# Altium schematic sheet RPi_CM3_SODIMM_200PIN_1V8.SchDoc: Las Cumbres
size B; DrawnBy: Cary Smith; Organization: Las Cumbres Observatoy; Address1: 6740 Cortona Dr.; Address2: Suite 102; Address3: Goleta, CA 93117; DocumentNumber: 1; Revision: 1; SheetNumber: 1; SheetTotal: 1000's
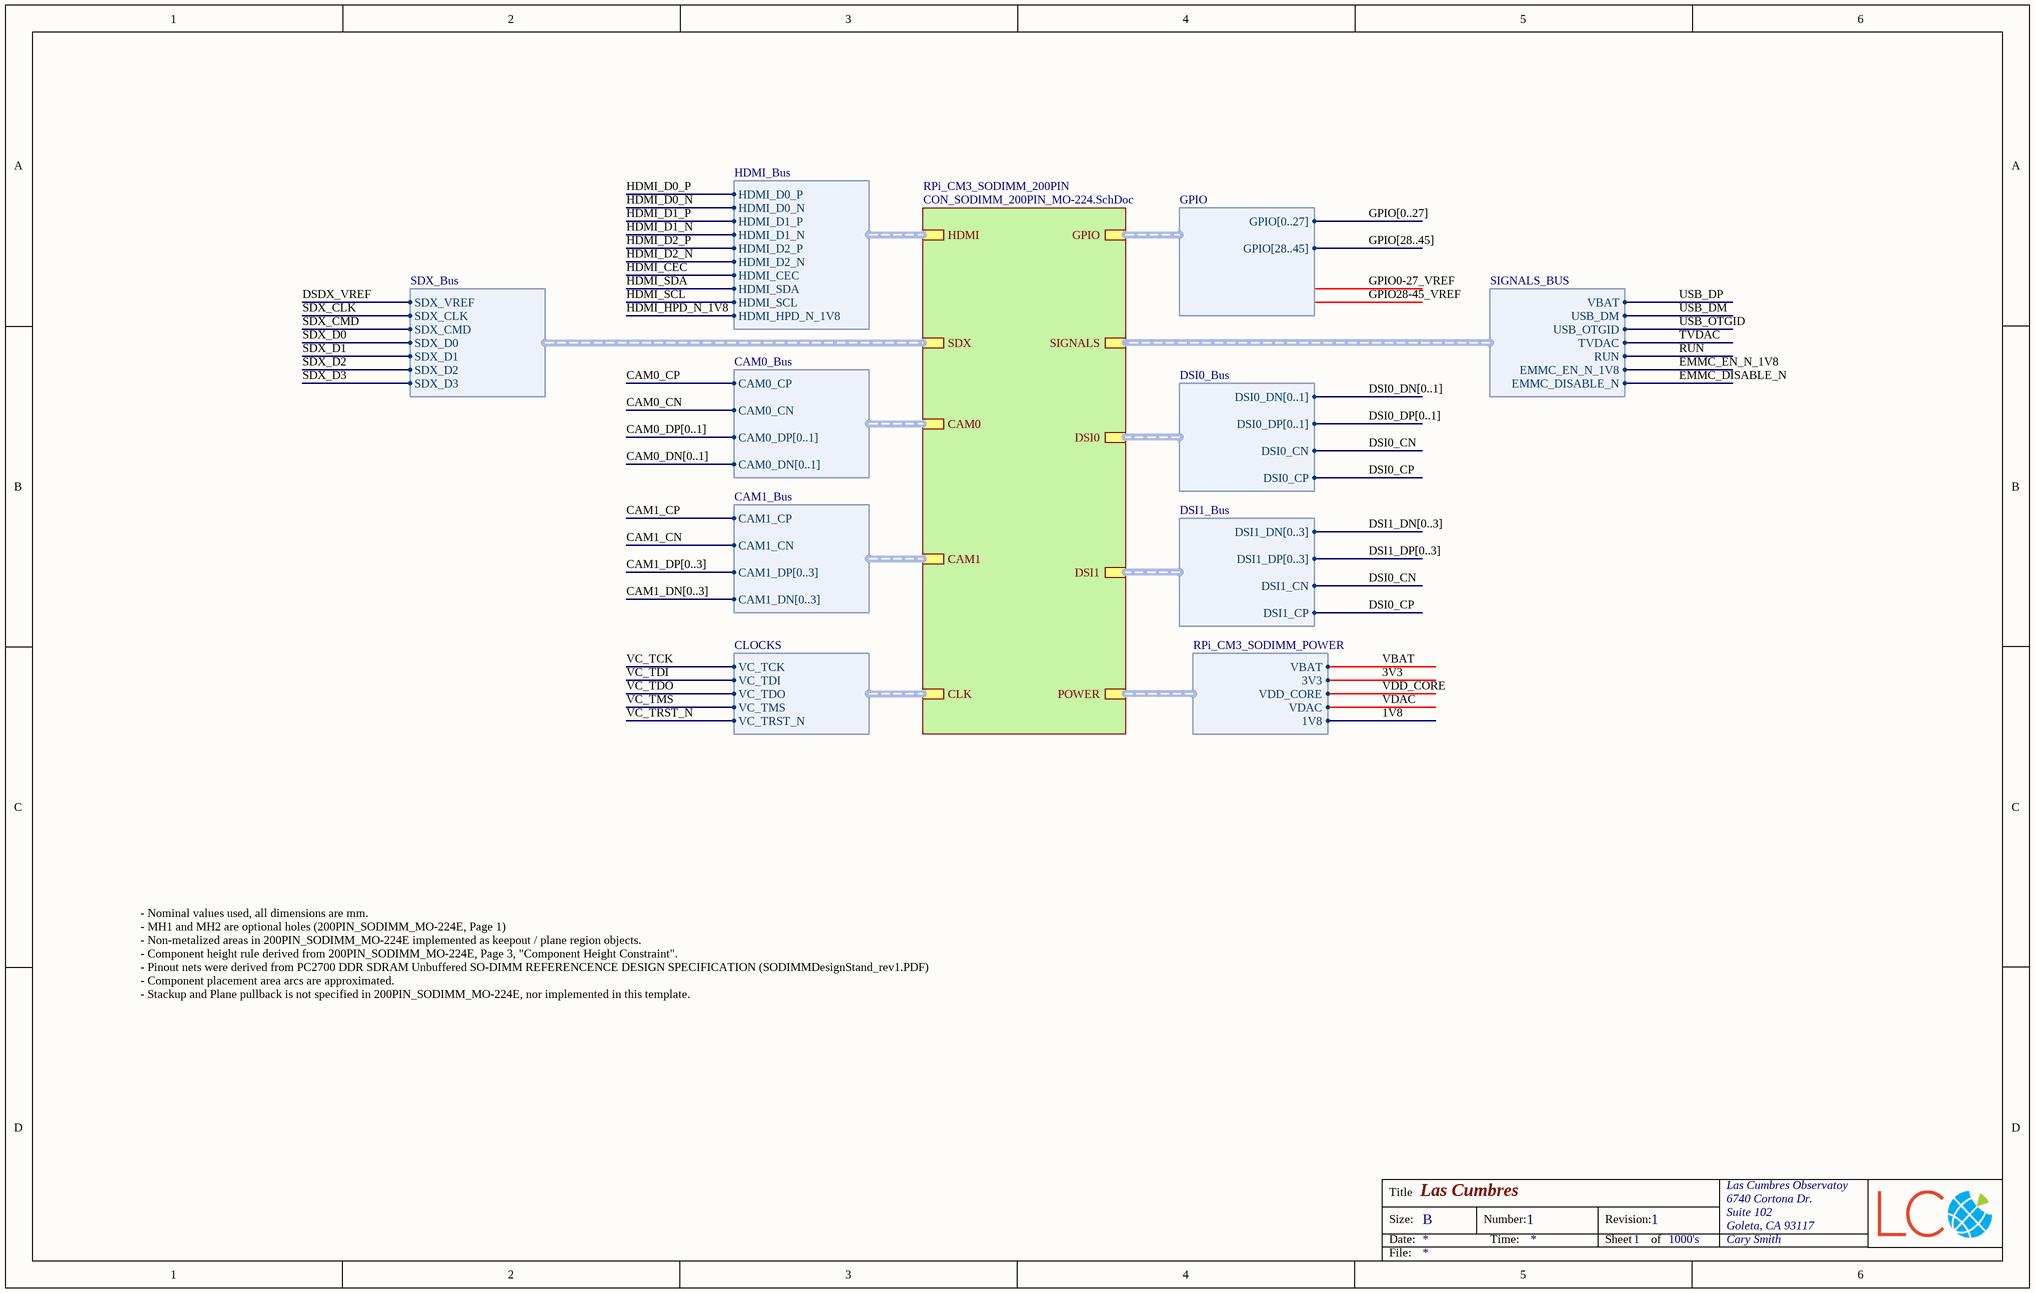
[diagram p0: RPi_CM3_SODIMM_200PIN_1V8.SchDoc]

## Sub-sheets
RPi_CM3_SODIMM_200PIN = CON_SODIMM_200PIN_MO-224.SchDoc: CLK (harness CLOCKS), POWER (harness RPi_CM3_SODIMM_POWER), CAM1 (harness CAM1_Bus), CAM0 (harness CAM0_Bus), HDMI (harness HDMI_Bus), GPIO (harness GPIO), DSI1 (harness DSI1_Bus), DSI0 (harness DSI0_Bus), SIGNALS (harness SIGNALS_BUS), SDX (harness SDX_Bus)

## Harnesses
DSI0_Bus: DSI0_DN[0..1], DSI0_DP[0..1], DSI0_CN, DSI0_CP
CLOCKS: VC_TCK, VC_TDO, VC_TMS, VC_TRST_N, VC_TDI
GPIO: GPIO[0..27], GPIO[28..45]
DSI1_Bus: DSI1_DN[0..3], DSI1_DP[0..3], DSI1_CN, DSI1_CP
CAM1_Bus: CAM1_DN[0..3], CAM1_DP[0..3], CAM1_CN, CAM1_CP
CAM0_Bus: CAM0_DN[0..1], CAM0_DP[0..1], CAM0_CN, CAM0_CP
HDMI_Bus: HDMI_D1_P, HDMI_D0_N, HDMI_D0_P, HDMI_D2_N, HDMI_D1_N, HDMI_D2_P, HDMI_CEC, HDMI_SDA, HDMI_SCL, HDMI_HPD_N_1V8
RPi_CM3_SODIMM_POWER: VBAT, 3V3, VDAC, 1V8, VDD_CORE
SIGNALS_BUS: VBAT, USB_DM, USB_OTGID, TVDAC, RUN, EMMC_EN_N_1V8, EMMC_DISABLE_N
SDX_Bus: SDX_CMD, SDX_CLK, SDX_VREF, SDX_D2, SDX_D0, SDX_D1, SDX_D3

## Nets
1V8: sheet RPi_CM3_SODIMM_200PIN/POWER.1V8
3V3: sheet RPi_CM3_SODIMM_200PIN/POWER.3V3
CAM0_CN: sheet RPi_CM3_SODIMM_200PIN/CAM0.CAM0_CN
CAM0_CP: sheet RPi_CM3_SODIMM_200PIN/CAM0.CAM0_CP
CAM1_CN: sheet RPi_CM3_SODIMM_200PIN/CAM1.CAM1_CN
CAM1_CP: sheet RPi_CM3_SODIMM_200PIN/CAM1.CAM1_CP
DSDX_VREF: sheet RPi_CM3_SODIMM_200PIN/SDX.SDX_VREF
DSI0_CN: sheet RPi_CM3_SODIMM_200PIN/DSI0.DSI0_CN, sheet RPi_CM3_SODIMM_200PIN/DSI1.DSI1_CN
DSI0_CP: sheet RPi_CM3_SODIMM_200PIN/DSI0.DSI0_CP, sheet RPi_CM3_SODIMM_200PIN/DSI1.DSI1_CP
EMMC_DISABLE_N: sheet RPi_CM3_SODIMM_200PIN/SIGNALS.EMMC_DISABLE_N
EMMC_EN_N_1V8: sheet RPi_CM3_SODIMM_200PIN/SIGNALS.EMMC_EN_N_1V8
HDMI_CEC: sheet RPi_CM3_SODIMM_200PIN/HDMI.HDMI_CEC
HDMI_D0_N: sheet RPi_CM3_SODIMM_200PIN/HDMI.HDMI_D0_N
HDMI_D0_P: sheet RPi_CM3_SODIMM_200PIN/HDMI.HDMI_D0_P
HDMI_D1_N: sheet RPi_CM3_SODIMM_200PIN/HDMI.HDMI_D1_N
HDMI_D1_P: sheet RPi_CM3_SODIMM_200PIN/HDMI.HDMI_D1_P
HDMI_D2_N: sheet RPi_CM3_SODIMM_200PIN/HDMI.HDMI_D2_N
HDMI_D2_P: sheet RPi_CM3_SODIMM_200PIN/HDMI.HDMI_D2_P
HDMI_HPD_N_1V8: sheet RPi_CM3_SODIMM_200PIN/HDMI.HDMI_HPD_N_1V8
HDMI_SCL: sheet RPi_CM3_SODIMM_200PIN/HDMI.HDMI_SCL
HDMI_SDA: sheet RPi_CM3_SODIMM_200PIN/HDMI.HDMI_SDA
RUN: sheet RPi_CM3_SODIMM_200PIN/SIGNALS.RUN
SDX_CLK: sheet RPi_CM3_SODIMM_200PIN/SDX.SDX_CLK
SDX_CMD: sheet RPi_CM3_SODIMM_200PIN/SDX.SDX_CMD
SDX_D0: sheet RPi_CM3_SODIMM_200PIN/SDX.SDX_D0
SDX_D1: sheet RPi_CM3_SODIMM_200PIN/SDX.SDX_D1
SDX_D2: sheet RPi_CM3_SODIMM_200PIN/SDX.SDX_D2
SDX_D3: sheet RPi_CM3_SODIMM_200PIN/SDX.SDX_D3
TVDAC: sheet RPi_CM3_SODIMM_200PIN/SIGNALS.TVDAC
USB_DM: sheet RPi_CM3_SODIMM_200PIN/SIGNALS.USB_DM
USB_DP: sheet RPi_CM3_SODIMM_200PIN/SIGNALS.VBAT
USB_OTGID: sheet RPi_CM3_SODIMM_200PIN/SIGNALS.USB_OTGID
VBAT: sheet RPi_CM3_SODIMM_200PIN/POWER.VBAT
VC_TCK: sheet RPi_CM3_SODIMM_200PIN/CLK.VC_TCK
VC_TDI: sheet RPi_CM3_SODIMM_200PIN/CLK.VC_TDI
VC_TDO: sheet RPi_CM3_SODIMM_200PIN/CLK.VC_TDO
VC_TMS: sheet RPi_CM3_SODIMM_200PIN/CLK.VC_TMS
VC_TRST_N: sheet RPi_CM3_SODIMM_200PIN/CLK.VC_TRST_N
VDAC: sheet RPi_CM3_SODIMM_200PIN/POWER.VDAC
VDD_CORE: sheet RPi_CM3_SODIMM_200PIN/POWER.VDD_CORE

## Buses and harness runs
bus CAM0_DN[0..1]
bus CAM0_DP[0..1]
bus CAM1_DN[0..3]
bus CAM1_DP[0..3]
bus DSI0_DN[0..1]
bus DSI0_DP[0..1]
bus DSI1_DN[0..3]
bus DSI1_DP[0..3]
bus GPIO[0..27]
bus GPIO[28..45]

## Notes on the sheet
- - Nominal values used, all dimensions are mm.
  - MH1 and MH2 are optional holes (200PIN_SODIMM_MO-224E, Page 1)
  - Non-metalized areas in 200PIN_SODIMM_MO-224E implemented as keepout / plane region objects.
  - Component height rule derived from 200PIN_SODIMM_MO-224E, Page 3, "Component Height Constraint".
  - Pinout nets were derived from PC2700 DDR SDRAM Unbuffered SO-DIMM REFERENCENCE DESIGN SPECIFICATION (SODIMMDesignStand_rev1.PDF)
  - Component placement area arcs are approximated.
  - Stackup and Plane pullback is not specified in 200PIN_SODIMM_MO-224E, nor implemented in this template.
- Title
- Size:
- Date:
- B
- Number:
- Time:
- Revision:
- Sheet
- of
- File: